# Altium schematic sheet uc.SchDoc: Controller
size A; Organization: Cal Poly Racing; engineer1: Graydon Wilson
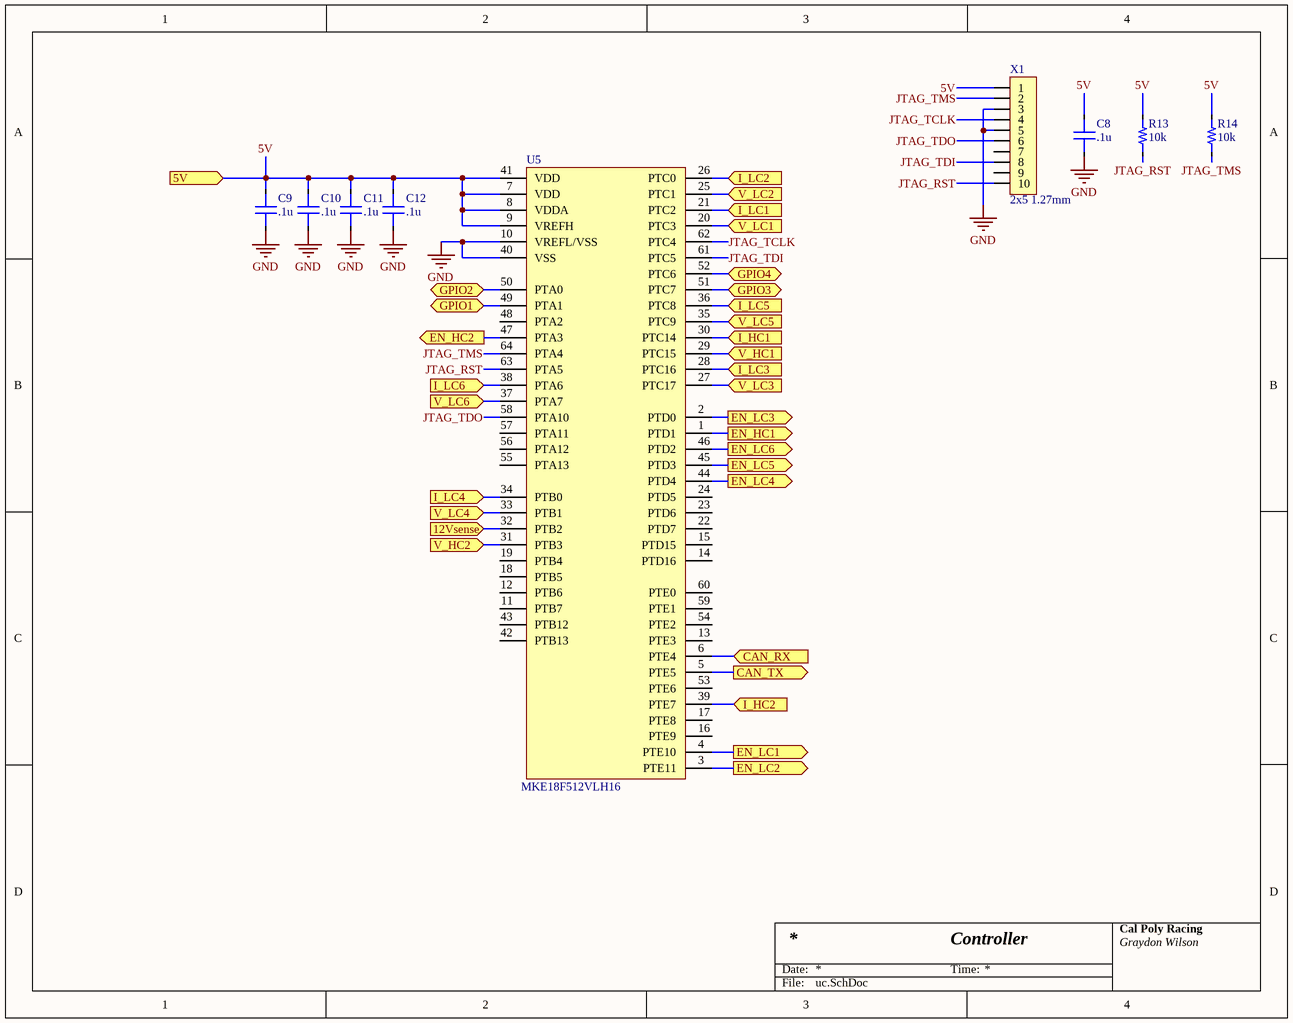
[diagram p0: uc.SchDoc]

## Parts
C8  value .1u  [0603_CAP]  (hidden comment: Capacitor)
C9  value .1u  [0603_CAP]  (hidden comment: Capacitor)
C10  value .1u  [0603_CAP]  (hidden comment: Capacitor)
C11  value .1u  [0603_CAP]  (hidden comment: Capacitor)
C12  value .1u  [0603_CAP]  (hidden comment: Capacitor)
R13  value 10k  [0603_RES]  (hidden comment: Resistor)
R14  value 10k  [0603_RES]  (hidden comment: Resistor)
U5  MKE18F512VLH16  [TQFP64]
X1  2x5 1.27mm  [2x5 1.27mm th]

## Ports
5V (in), 12Vsense (in), CAN_RX (in), CAN_TX (out), EN_HC1 (out), EN_HC2 (out), EN_LC1 (out), EN_LC2 (out), EN_LC3 (out), EN_LC4 (out), EN_LC5 (out), EN_LC6 (out), GPIO1 (bidir), GPIO2 (bidir), GPIO3 (bidir), GPIO4 (bidir), I_HC1 (in), I_HC2 (in), I_LC1 (in), I_LC2 (in), I_LC3 (in), I_LC4 (in), I_LC5 (in), I_LC6 (in), V_HC1 (in), V_HC2 (in), V_LC1 (in), V_LC2 (in), V_LC3 (in), V_LC4 (in), V_LC5 (in), V_LC6 (in)

## Nets
GND: C8.1 C9.1 C10.1 C11.1 C12.1 U5.10(VREFL/VSS) U5.40(VSS) X1.3 X1.5
5V: C8.2 C9.2 C10.2 C11.2 C12.2 R13.2 R14.2 U5.7(VDD) U5.8(VDDA) U5.9(VREFH) U5.41(VDD) X1.1 ; port 5V
12Vsense: U5.32(PTB2) ; port 12Vsense
CAN_RX: U5.6(PTE4) ; port CAN_RX
CAN_TX: U5.5(PTE5) ; port CAN_TX
EN_HC1: U5.1(PTD1) ; port EN_HC1
EN_HC2: U5.47(PTA3) ; port EN_HC2
EN_LC1: U5.4(PTE10) ; port EN_LC1
EN_LC2: U5.3(PTE11) ; port EN_LC2
EN_LC3: U5.2(PTD0) ; port EN_LC3
EN_LC4: U5.44(PTD4) ; port EN_LC4
EN_LC5: U5.45(PTD3) ; port EN_LC5
EN_LC6: U5.46(PTD2) ; port EN_LC6
GPIO1: U5.49(PTA1) ; port GPIO1
GPIO2: U5.50(PTA0) ; port GPIO2
GPIO3: U5.51(PTC7) ; port GPIO3
GPIO4: U5.52(PTC6) ; port GPIO4
I_HC1: U5.30(PTC14) ; port I_HC1
I_HC2: U5.39(PTE7) ; port I_HC2
I_LC1: U5.21(PTC2) ; port I_LC1
I_LC2: U5.26(PTC0) ; port I_LC2
I_LC3: U5.28(PTC16) ; port I_LC3
I_LC4: U5.34(PTB0) ; port I_LC4
I_LC5: U5.36(PTC8) ; port I_LC5
I_LC6: U5.38(PTA6) ; port I_LC6
JTAG_RST: R13.1 U5.63(PTA5) X1.10
JTAG_TCLK: U5.62(PTC4) X1.4
JTAG_TDI: U5.61(PTC5) X1.8
JTAG_TDO: U5.58(PTA10) X1.6
JTAG_TMS: R14.1 U5.64(PTA4) X1.2
V_HC1: U5.29(PTC15) ; port V_HC1
V_HC2: U5.31(PTB3) ; port V_HC2
V_LC1: U5.20(PTC3) ; port V_LC1
V_LC2: U5.25(PTC1) ; port V_LC2
V_LC3: U5.27(PTC17) ; port V_LC3
V_LC4: U5.33(PTB1) ; port V_LC4
V_LC5: U5.35(PTC9) ; port V_LC5
V_LC6: U5.37(PTA7) ; port V_LC6

Not connected (* = marked no-connect by the designer): U5 11(PTB7) 12(PTB6) 13(PTE3) 14(PTD16) 15(PTD15) 16(PTE9) 17(PTE8) 18(PTB5) 19(PTB4) 22(PTD7) 23(PTD6) 24(PTD5) 42(PTB13) 43(PTB12) 48(PTA2) 53(PTE6) 54(PTE2) 55(PTA13) 56(PTA12) 57(PTA11) 59(PTE1) 60(PTE0); X1 7 9

## Notes on the sheet
- Date:
- Time:
- File:

## Library data of the parts
U5 = MKE18F512VLH16: Vcc: 2.7-5.5; Package: TQFP64
X1 = 2x5 1.27mm: Circuits: 10; Name: 2x5 1.27mm; ComponentLink1Description: Digikey; ComponentLink1URL: https://www.digikey.com/product-detail/en/samtec-inc/FTSH-105-01-F-D-K/SAM8909-ND/1850757
C8-C12 = Capacitor: Dielectric: *; Percent Tolerance: *; ESR: *
R13 R14 = Resistor: Tolerance: *